# EAGLE design OSO-MISC-20-029 Sound + SD (EAGLE 9.6.2)
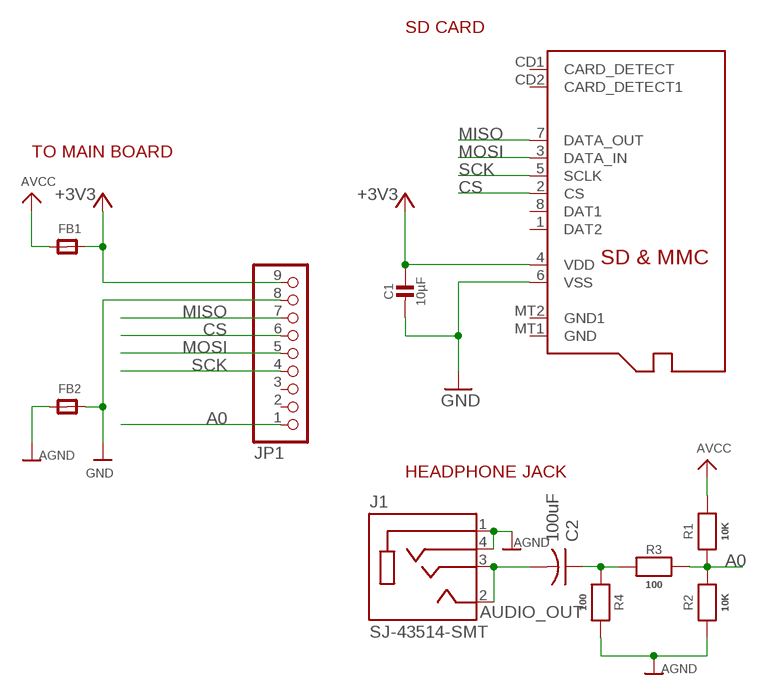
[diagram p0: schematic, sheet 1]

## Parts
C1  10µF  CAP_CERAMIC0805-NOOUTLINE  [0805-NO]
C2  100uF  C-USC1210  [C1210]
FB1  FERRITE0805  [0805]
FB2  FERRITE0805  [0805]
J1  SJ-43514-SMT  [CUI_SJ-43514-SMT]
JP1  HEADER-1X9_JSTSH  [JST_SH9]
MICROSD  MICROSD  [MICROSD]
R1  10K  RESISTOR_0805MP  [_0805MP]
R2  10K  RESISTOR_0805MP  [_0805MP]
R3  100  RESISTOR_0805MP  [_0805MP]
R4  100  RESISTOR_0805MP  [_0805MP]

## Nets
+3V3 [power]: C1.1 FB1.2 JP1.9 MICROSD.4(VDD)
A0: JP1.1 R1.2 R2.1 R3.1
AGND: FB2.1 J1.1(SLEEVE) J1.4(RING2) R2.2 R4.1
AUDIO_OUT: C2.2 J1.2(TIP) J1.3(RING1)
AVCC: FB1.1 R1.1
CS: JP1.6 MICROSD.2(CS)
GND [gnd]: C1.2 FB2.2 JP1.8 MICROSD.6(VSS)
MISO: JP1.7 MICROSD.7(DATA_OUT)
MOSI: JP1.5 MICROSD.3(DATA_IN)
N$1: C2.1 R3.2 R4.2
SCK: JP1.4 MICROSD.5(SCLK)
Unconnected: JP1.2 JP1.3 MICROSD.1(DAT2) MICROSD.8(DAT1) MICROSD.CD1(CARD_DETECT) MICROSD.CD2(CARD_DETECT1) MICROSD.MT1(GND) MICROSD.MT2(GND1)

## Notes on the sheet
- SD CARD
- TO MAIN BOARD
- HEADPHONE JACK

## Library data of the parts
C1 = microbuilder:CAP_CERAMIC: Ceramic Capacitors For new designs, use the packages preceded by an '_' character since they are more reliable: The following footprints should be used on most boards: _0402 - Standard footprint for regular board layouts _0603 - Standard footprint for regular board layouts _0805 - Standard footprint for regular board layouts _1206 - Standard footprint for regular board layouts For extremely tight-pitch boards where space is at a premium, the following 'micro-pitch' footprints can be used (smaller pads, no silkscreen outline, etc.): _0402MP - Micro-pitch footprint for very dense/compact boards _0603MP - Micro-pitch footprint for very dense/compact boards _0805MP - Micro-pitch footprint for very dense/compact boards _1206MP - Micro-pitch footprint for very dense/compact boards
C2 = resistor:C-US: CAPACITOR, American symbol
FB1 FB2 = pygamer-microbuilder:FERRITE: Ferrite Bead 0603 MMZ1608B121C - 120 Ohm @ 100MHz, 600mA, 0.15 Ohm DC Resistance - Digikey: 445-2164-1-ND BK1608HW121-T - 120 Ohm, 600mA Ferrite Chip - Digikey: 587-1876-2-ND 0805 HZ0805B272R-10 - 2.7K Ohm @ 100MHz, 200mA, 0.8 Ohm DC Resistance - Digikey: 240-2504-1-ND (see also Murata BLM21BD272SN1L) MMZ2012Y152B - 1.5K Ohm @ 100MHz, 500mA, 0.4 Ohm DC Resistance - Digikey: 445-1560-1-ND - Mainly for high frequency (80-400MHz) MMZ2012R102A - 1K Ohm @ 100MHz, 500mA, 0.3 Ohm DC Resistance - Digikey: 445-1555-2-ND - More general purpose (10-200MHz)
J1 = SJ-43514-SMT:SJ-43514-SMT: 4 conductor 3.5 mm Surface Mount Audio Jack; CUI_PURCHASE_URL: https://www.cui.com/product/interconnect/connectors/audio-connectors/jacks/sj-4351x-smt-series?utm_source=snapeda.com&utm_medium=referral&utm_campaign=snapedaBOM; DESCRIPTION: 3.5 mm, 4 Conductors, Right Angle, Surface Mount _SMT_, Audio Jack Connector; DIGI-KEY_PART_NUMBER: CP-43514SJCT-ND; DIGI-KEY_PURCHASE_URL: https://www.digikey.com/product-detail/en/cui-inc/SJ-43514-SMT-TR/CP-43514SJCT-ND/669734?utm_source=snapeda&utm_medium=aggregator&utm_campaign=symbol; MF: CUI Inc.; MP: SJ-43514-SMT-TR; PACKAGE: None
JP1 = microbuilder:HEADER-1X9: PIN HEADER
MICROSD = adafruit:MICROSD: Micro-SD / Transflash card holder with SPI pinout For the 3M # 2908-05WB-MG and/or 4UCON #19656 push-push type
R1-R4 = microbuilder:RESISTOR: Resistors For new designs, use the packages preceded by an '_' character since they are more reliable: The following footprints should be used on most boards: _0402 - Standard footprint for regular board layouts _0603 - Standard footprint for regular board layouts _0805 - Standard footprint for regular board layouts _1206 - Standard footprint for regular board layouts For extremely tight-pitch boards where space is at a premium, the following 'micro-pitch' footprints can be used (smaller pads, no silkscreen outline, etc.): _0402MP - Micro-pitch footprint for very dense/compact boards _0603MP - Micro-pitch footprint for very dense/compact boards _0805MP - Micro-pitch footprint for very dense/compact boards _1206MP - Micro-pitch footprint for very dense/compact boards

## Net classes
0 default: width 0.152 mm
1 power: width 0.254 mm, drill 0.305 mm
2 gnd: width 0.254 mm, drill 0.254 mm

## Board
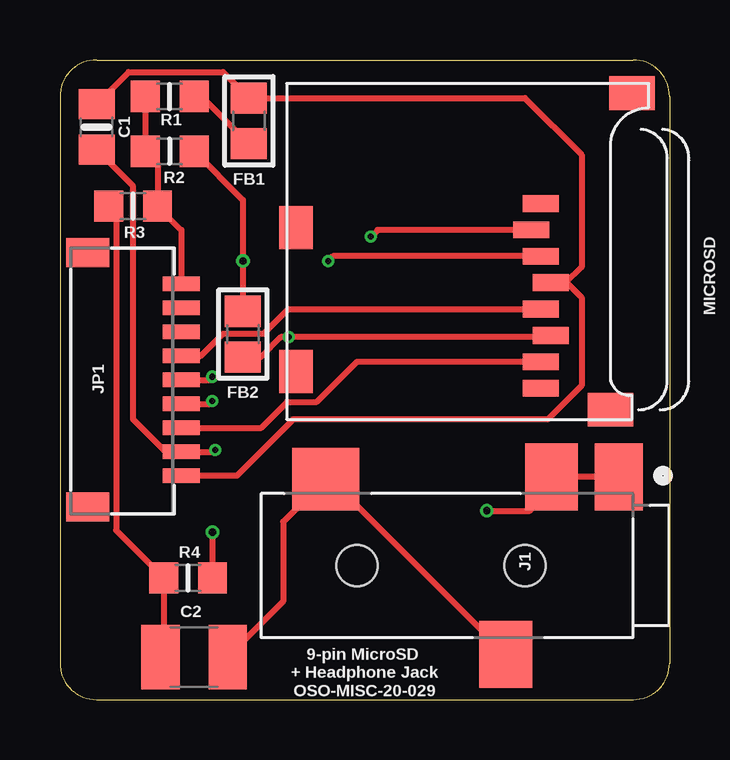
[diagram p1: board, top side]
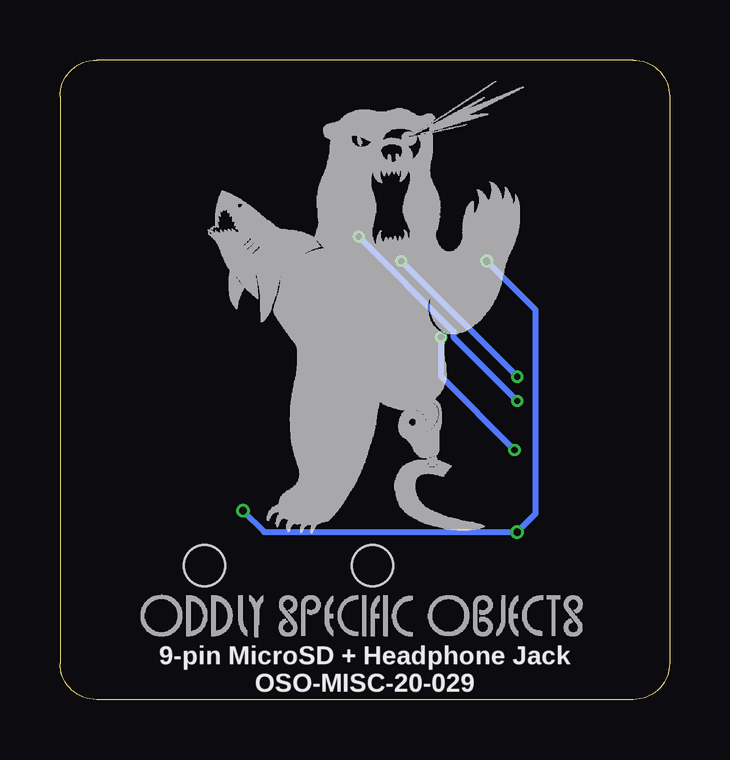
[diagram p2: board, bottom side, seen from below]

Size 25.4 x 26.67 mm. Coordinates in mm from the lower left corner, seen from the top.
Outline: 25.4,25.15 arc90 23.88,26.67 1.52,26.67 arc90 0,25.15 0,1.52 arc90 1.52,0 23.88,0 arc90 25.4,1.52 25.4,25.15
Copper layers (1*16): Top 0.035559375mm / dielectric 1.6mm / Bottom 0.035559375mm
Design rules "oshpark-2layer *": minimum track width 6mil, minimum drill 10mil, track to track 6mil, track to pad 6mil, pad to pad 6mil, via to via 6mil, smd to smd 6mil, copper to edge 15mil, drill to drill 6mil, minimum pad ring 5mil, minimum via ring 5mil, stop-mask expansion 2.5mil, vias tented up to drill 12mil, thermal gap 10mil

### Footprints (pad centres in the part's own frame; a part is rotated, then mirrored left to right if it is on the bottom)
0805-NO = smd 1.24 x 1.5: 1 -0.95,0; 2 0.95,0
C1210 = smd 1.6 x 2.7: 1 -1.4,0; 2 1.4,0
0805 = smd 1.3 x 1.5: 1 -0.95,0; 2 0.95,0
CUI_SJ-43514-SMT = smd 2 x 2.8: 1 -7.15,-3.7 | smd 2.8 x 2.6: 2 5.05,-3.6 | smd 2.2 x 2.8: 3 -2.45,3.7; 4 -4.35,-3.7 | hole 1.7: -3.25,0; 3.75,0
JST_SH9 = smd 0.6 x 1.55: 1 -4,2.514; 2 -3,2.514; 3 -2,2.514; 4 -1,2.514; 5 0,2.514; 6 1,2.514; 7 2,2.514; 8 3,2.514; 9 4,2.514 | smd 1.2 x 1.8: MT1 -5.3,-1.386; MT2 5.3,-1.386
MICROSD = smd 0.7 x 1.5: 1 9,-10.64; 2 7.9,-10.24; 3 6.8,-10.64; 4 5.7,-11.04; 5 4.6,-10.64; 6 3.5,-11.04; 7 2.4,-10.64; 8 1.3,-10.64 | smd 1.8 x 1.4: CD1 2,-0.44; CD2 8,-0.44 | smd 1.4 x 1.9: MT1 0.4,-13.54; MT2 13.6,-14.44
_0805MP = smd 1.2 x 1.3: 1 -1.016,0; 2 1.016,0

### Placement (x,y rotation side)
C1  1.52,23.88 270 top
C2  5.59,1.78 0 top
FB1  7.87,24.13 90 top
FB2  7.62,15.24 270 top
J1  16.13,5.59 180 top
JP1  2.54,13.34 270 top
MICROSD  9.4,11.68 90 top
R1  4.57,25.15 180 top
R2  4.57,22.86 0 top
R3  3.05,20.57 180 top
R4  5.33,5.08 180 top
U$4  [OSO_BEAR_525X750MIL_1000DPI]  12.7,16.38 0 bottom
U$5  [OSO_WORDMARK_ONELINE_725MIL_1000DPI]  22.1,2.54 0 bottom

### Tracks (layer width: path | path; a pad name or v marks a point on that pad's centre or on a via)
+3V3
  Top 0.254: JP1.9 7.37,9.34 9.71,11.68 20.32,11.68 21.73,13.1 21.73,16.76 21.11,17.38 MICROSD.4 21.08,17.38 21.73,18.03 21.73,22.72 19.37,25.08 FB1.2 6.79,26.16 2.86,26.16 C1.1
A0
  Top 0.254: R1.2 R2.1 4.06,22.35 R3.1 5.05,19.58 JP1.1
AGND  (via drill 0.3)
  Top 0.254: R2.2 7.62,20.83 v7.62,18.29 FB2.1 | v6.35,6.99 R4.1 | v17.78,7.87 19.57,7.87 20.48,8.78 J1.4 J1.1
  Bottom 0.254: v7.62,18.29 5.59,16.26 5.59,7.75 v6.35,6.99 16.89,6.99 v17.78,7.87
AUDIO_OUT
  Top 0.254: C2.2 9.3,4.09 9.3,7.41 J1.2 11.28,9.19 J1.3
AVCC
  Top 0.254: R1.1 5.91,25.15 FB1.1
CS  (via drill 0.25)
  Top 0.254: MICROSD.2 13.23,19.58 v12.95,19.3 | JP1.6 6.24,12.34 v6.35,12.45
  Bottom 0.254: v6.35,12.45 8.99,15.09 8.99,15.33 v12.95,19.3
GND  (via drill 0.25)
  Top 0.254: v6.46,10.41 6.38,10.34 JP1.8 4.4,10.34 3.05,11.68 3.05,21.4 C1.2 | MICROSD.6 20.37,15.11 v9.53,15.11 9.21,15.11 8.38,14.29 FB2.2
  Bottom 0.254: v6.46,10.41 9.53,13.48 v9.53,15.11
MISO
  Top 0.254: JP1.7 8.38,11.34 9.46,12.42 10.7,12.42 12.37,14.08 MICROSD.7
MOSI  (via drill 0.25)
  Top 0.254: JP1.5 6.22,13.34 v6.35,13.46 | MICROSD.3 11.37,18.48 v11.18,18.29
  Bottom 0.254: v6.35,13.46 v11.18,18.29
N$1
  Top 0.254: R3.2 2.33,20.27 2.33,7.07 R4.2 4.32,1.91 C2.1
SCK
  Top 0.254: JP1.4 5.87,14.34 6.79,15.26 8.49,15.26 9.51,16.28 MICROSD.5

### Text on the board
tPlace: 9-pin MicroSD / + Headphone Jack / OSO-MISC-20-029
bPlace: 9-pin MicroSD + Headphone Jack / OSO-MISC-20-029